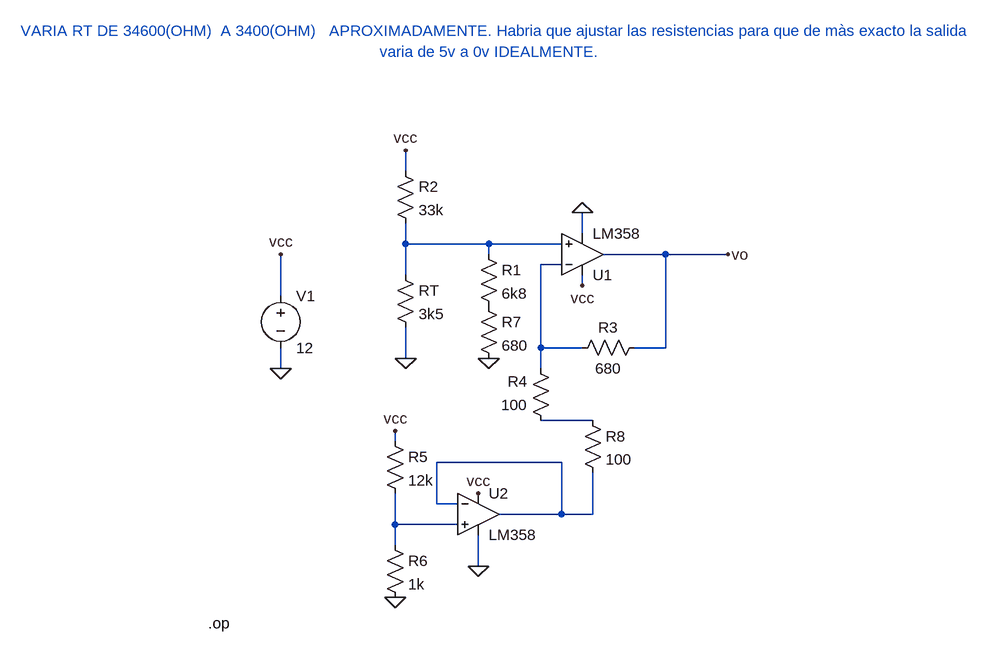
[diagram p0: schematic Sensor Temperatura.asc]
Sensor Temperatura.asc, the LTspice schematic file:
Version 4
SHEET 1 1372 772
WIRE 48 32 48 0
WIRE 320 128 320 96
WIRE 48 144 48 112
WIRE 176 144 48 144
WIRE 288 144 176 144
WIRE 176 160 176 144
WIRE 448 160 352 160
WIRE 544 160 448 160
WIRE 288 176 256 176
WIRE 48 192 48 144
WIRE 320 208 320 192
WIRE -144 224 -144 160
WIRE 256 304 256 176
WIRE 320 304 256 304
WIRE 448 304 448 160
WIRE 448 304 400 304
WIRE 48 320 48 272
WIRE -144 336 -144 304
WIRE 256 336 256 304
WIRE 336 416 256 416
WIRE 32 448 32 432
WIRE 288 480 96 480
WIRE 96 544 96 480
WIRE 128 544 96 544
WIRE 288 560 288 480
WIRE 288 560 192 560
WIRE 336 560 336 496
WIRE 336 560 288 560
WIRE 32 576 32 528
WIRE 128 576 32 576
WIRE 32 608 32 576
WIRE 160 640 160 592
FLAG 176 320 0
FLAG 48 320 0
FLAG 48 0 vcc
FLAG 320 208 vcc
FLAG 160 528 vcc
FLAG 32 688 0
FLAG 32 432 vcc
FLAG -144 336 0
FLAG -144 160 vcc
FLAG 544 160 vo
FLAG 160 640 0
FLAG 320 96 0
SYMBOL res 32 16 R0
WINDOW 0 36 40 Left 2
WINDOW 3 36 76 Left 2
SYMATTR InstName R2
SYMATTR Value 33k
SYMBOL res 32 176 R0
WINDOW 0 36 40 Left 2
WINDOW 3 36 76 Left 2
SYMATTR InstName RT
SYMATTR Value 3k5
SYMBOL res 160 144 R0
WINDOW 0 36 40 Left 2
WINDOW 3 36 76 Left 2
SYMATTR InstName R1
SYMATTR Value 6k8
SYMBOL res 416 288 R90
WINDOW 0 0 56 VBottom 2
WINDOW 3 32 56 VTop 2
SYMATTR InstName R3
SYMATTR Value 680
SYMBOL res 272 432 R180
WINDOW 0 36 76 Left 2
WINDOW 3 36 40 Left 2
SYMATTR InstName R4
SYMATTR Value 100
SYMBOL res 16 592 R0
WINDOW 0 36 40 Left 2
WINDOW 3 36 76 Left 2
SYMATTR InstName R6
SYMATTR Value 1k
SYMBOL voltage -144 208 R0
WINDOW 123 0 0 Left 2
WINDOW 39 0 0 Left 2
SYMATTR InstName V1
SYMATTR Value 12
SYMBOL res 16 432 R0
WINDOW 0 36 40 Left 2
WINDOW 3 36 76 Left 2
SYMATTR InstName R5
SYMATTR Value 12k
SYMBOL res 160 224 R0
WINDOW 0 36 40 Left 2
WINDOW 3 36 76 Left 2
SYMATTR InstName R7
SYMATTR Value 680
SYMBOL Opamps\\LM358 320 160 M180
SYMATTR InstName U1
SYMBOL Opamps\\LM358 160 560 R0
SYMATTR InstName U2
SYMBOL res 320 400 R0
WINDOW 0 36 40 Left 2
WINDOW 3 36 76 Left 2
SYMATTR InstName R8
SYMATTR Value 100
TEXT -256 728 Left 2 !.op
TEXT -544 -184 Left 2 ;VARIA RT DE 34600(OHM)  A 3400(OHM)   APROXIMADAMENTE. Habria que ajustar las resistencias para que de màs exacto la salida
TEXT 8 -152 Left 2 ;varia de 5v a 0v IDEALMENTE.

The netlist it stands for:
* Sensor Temperatura.asc
R2 vcc N001 33k
RT N001 0 3k5
R1 N001 P001 6k8
R3 vo N002 680
R4 N003 N002 100
R6 N005 0 1k
V1 vcc 0 12
R5 vcc N005 12k
R7 P001 0 680
* U1: LM358 (symbol Opamps\LM358 not available, pins judged from their places): In+=N001 In-=N002 V+=vcc V-=0 OUT=vo
* U2: LM358 (symbol Opamps\LM358 not available, pins judged from their places): In+=N005 In-=N004 V+=vcc V-=0 OUT=N004
R8 N003 N004 100
.op
* VARIA RT DE 34600(OHM)  A 3400(OHM)   APROXIMADAMENTE. Habria que ajustar las resistencias para que de màs exacto la salida
* varia de 5v a 0v IDEALMENTE.
.backanno
.end